# Altium schematic sheet LineDetector.SchDoc
size A4; SheetNumber: 1; SheetTotal: 1
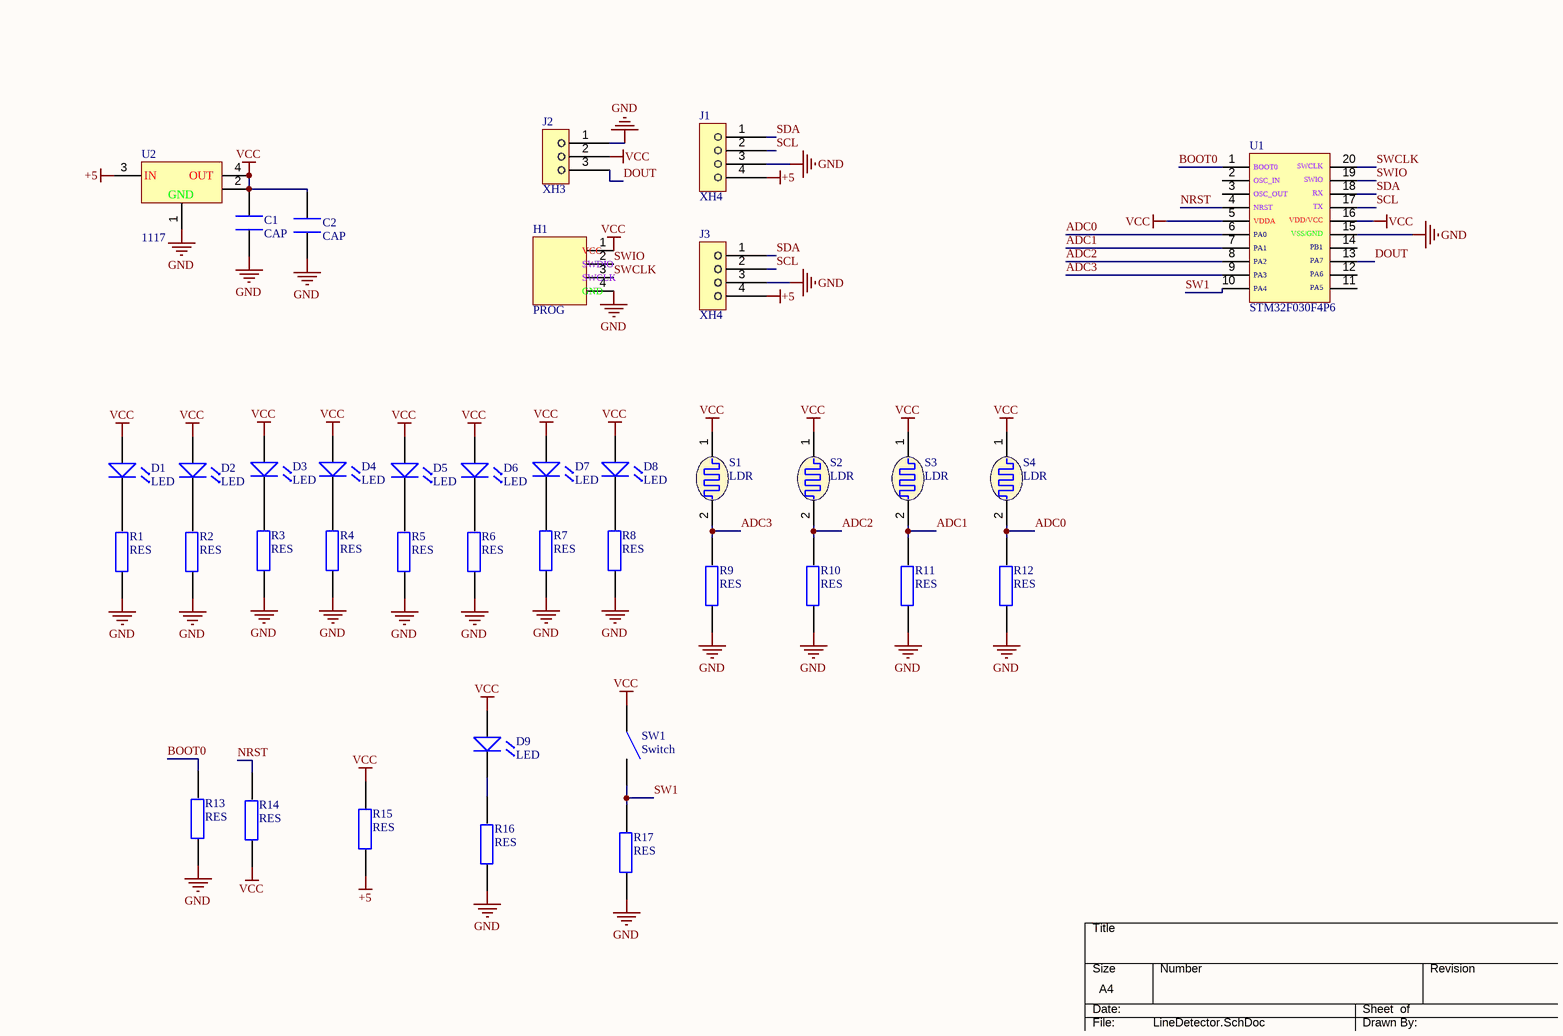
[diagram p0: LineDetector.SchDoc]

## Parts
C1  CAP  [CAP1206]
C2  CAP  [CAP1206]
D1  LED  [LED RED 1206]
D2  LED  [LED RED 1206]
D3  LED  [LED RED 1206]
D4  LED  [LED RED 1206]
D5  LED  [LED RED 1206]
D6  LED  [LED RED 1206]
D7  LED  [LED RED 1206]
D8  LED  [LED RED 1206]
D9  LED  [LED GREEN 1206]
H1  PROG  [PROGRAMER]
J1  XH4  [XH 4PIN]
J2  XH3  [XH 3PIN]
J3  XH4  [XH 4PIN]
R1  RES  [RES805]
R2  RES  [RES805]
R3  RES  [RES805]
R4  RES  [RES805]
R5  RES  [RES805]
R6  RES  [RES805]
R7  RES  [RES805]
R8  RES  [RES805]
R9  RES  [RES805]
R10  RES  [RES805]
R11  RES  [RES805]
R12  RES  [RES805]
R13  RES  [RES805]
R14  RES  [RES805]
R15  RES  [RES805]
R16  RES  [RES805]
R17  RES  [RES805]
S1  LDR  [LDR]
S2  LDR  [LDR]
S3  LDR  [LDR]
S4  LDR  [LDR]
SW1  Switch  [pushbutton]
U1  STM32F030F4P6  [STM32F030F4P6]
U2  1117  [AMS1117]

## Nets
+5: J1.4 J3.4 R15.1 U2.3
GND: C1.1 C2.1 H1.4 J1.3 J2.1 J3.3 R1.1 R2.1 R3.1 R4.1 R5.1 R6.1 R7.1 R8.1 R9.1 R10.1 R11.1 R12.1 R13.1 R16.1 R17.1 U1.15 U2.1
VCC: C1.2 C2.2 D1.1 D2.1 D3.1 D4.1 D5.1 D6.1 D7.1 D8.1 D9.1 H1.1 J2.2 R14.1 R15.2 S1.1 S2.1 S3.1 S4.1 SW1.1 U1.5 U1.16 U2.2 U2.4
ADC0: R12.2 S4.2 U1.6
ADC1: R11.2 S3.2 U1.7
ADC2: R10.2 S2.2 U1.8
ADC3: R9.2 S1.2 U1.9
BOOT0: R13.2 U1.1
DOUT: J2.3 U1.13
NRST: R14.2 U1.4
SCL: J1.2 J3.2 U1.17
SDA: J1.1 J3.1 U1.18
SW1: R17.2 SW1.2 U1.10
SWCLK: H1.3 U1.20
SWIO: H1.2 U1.19
NetD1_2: D1.2 R1.2
NetD2_2: D2.2 R2.2
NetD3_2: D3.2 R3.2
NetD4_2: D4.2 R4.2
NetD5_2: D5.2 R5.2
NetD6_2: D6.2 R6.2
NetD7_2: D7.2 R7.2
NetD8_2: D8.2 R8.2
NetD9_2: D9.2 R16.2

Not connected (* = marked no-connect by the designer): U1 2 3 11 12 14

## Notes on the sheet
- THIS DOCUMENT AND THE DATA DISCLOSED HEREIN OR
- HEREWITH IS THE PROPERTY OF ALTIUM LIMITED AND MAY
- DWG NO:
- REVISION
- REV:
- DESCRIPTION
- DATE
- APPROVED
- BE FREELY DISTRIBUTED IN WHOLE. NO RIGHTS ARE
- RESERVED OR EXPRESS OR IMPLIED WARANTEE GIVEN.
- ENG:
- APPROVALS
- PROJECT
- DSN:
- CHK:
- REFERENCE DOCUMENTS
- PROJECT REVISION:
- TITLE
- DOCUMENT REVISION:
- DESIGN ITEM:
- BOM:
- FAB DWG:
- PCB DWG:
- ASSY DWG:
- SCALE:
- A3
- SIZE
- CAGE CODE
- FILE NAME
- DWG NO.
- SHEET
- OF
- REV
- (in symbol AMS1117) IN; OUT; GND
- (in symbol Programmer) VCC; SWDIO; SWCLK; GND
- (in symbol STM32F030F4P6) BOOT0; SWCLK; OSC_IN; SWIO; OSC_OUT; RX; NRST; TX; VDDA; VDD/VCC; PA0; VSS/GND; PA1; PB1; PA2; PA7; PA3; PA6; PA4; PA5

## Library data of the parts
C1 C2 = CAP1206: Capacitor SMD 1206
D1-D9 = LED SMD 1206
H1 = Programmer
J1 J3 = XH 4PIN: XH Connector 4pins
J2 = XH 3PIN: XH Connector 3pins
R1-R17 = RES805: RESISTOR SMD
S1-S4 = LDR: Light Emmiting Diode - photocell
SW1 = pushbutton: Switch SMD Tact
U2 = AMS1117: 3.3v Regulator